# EAGLE design LIDAR_Motorsteuerung (EAGLE 7.6.0)
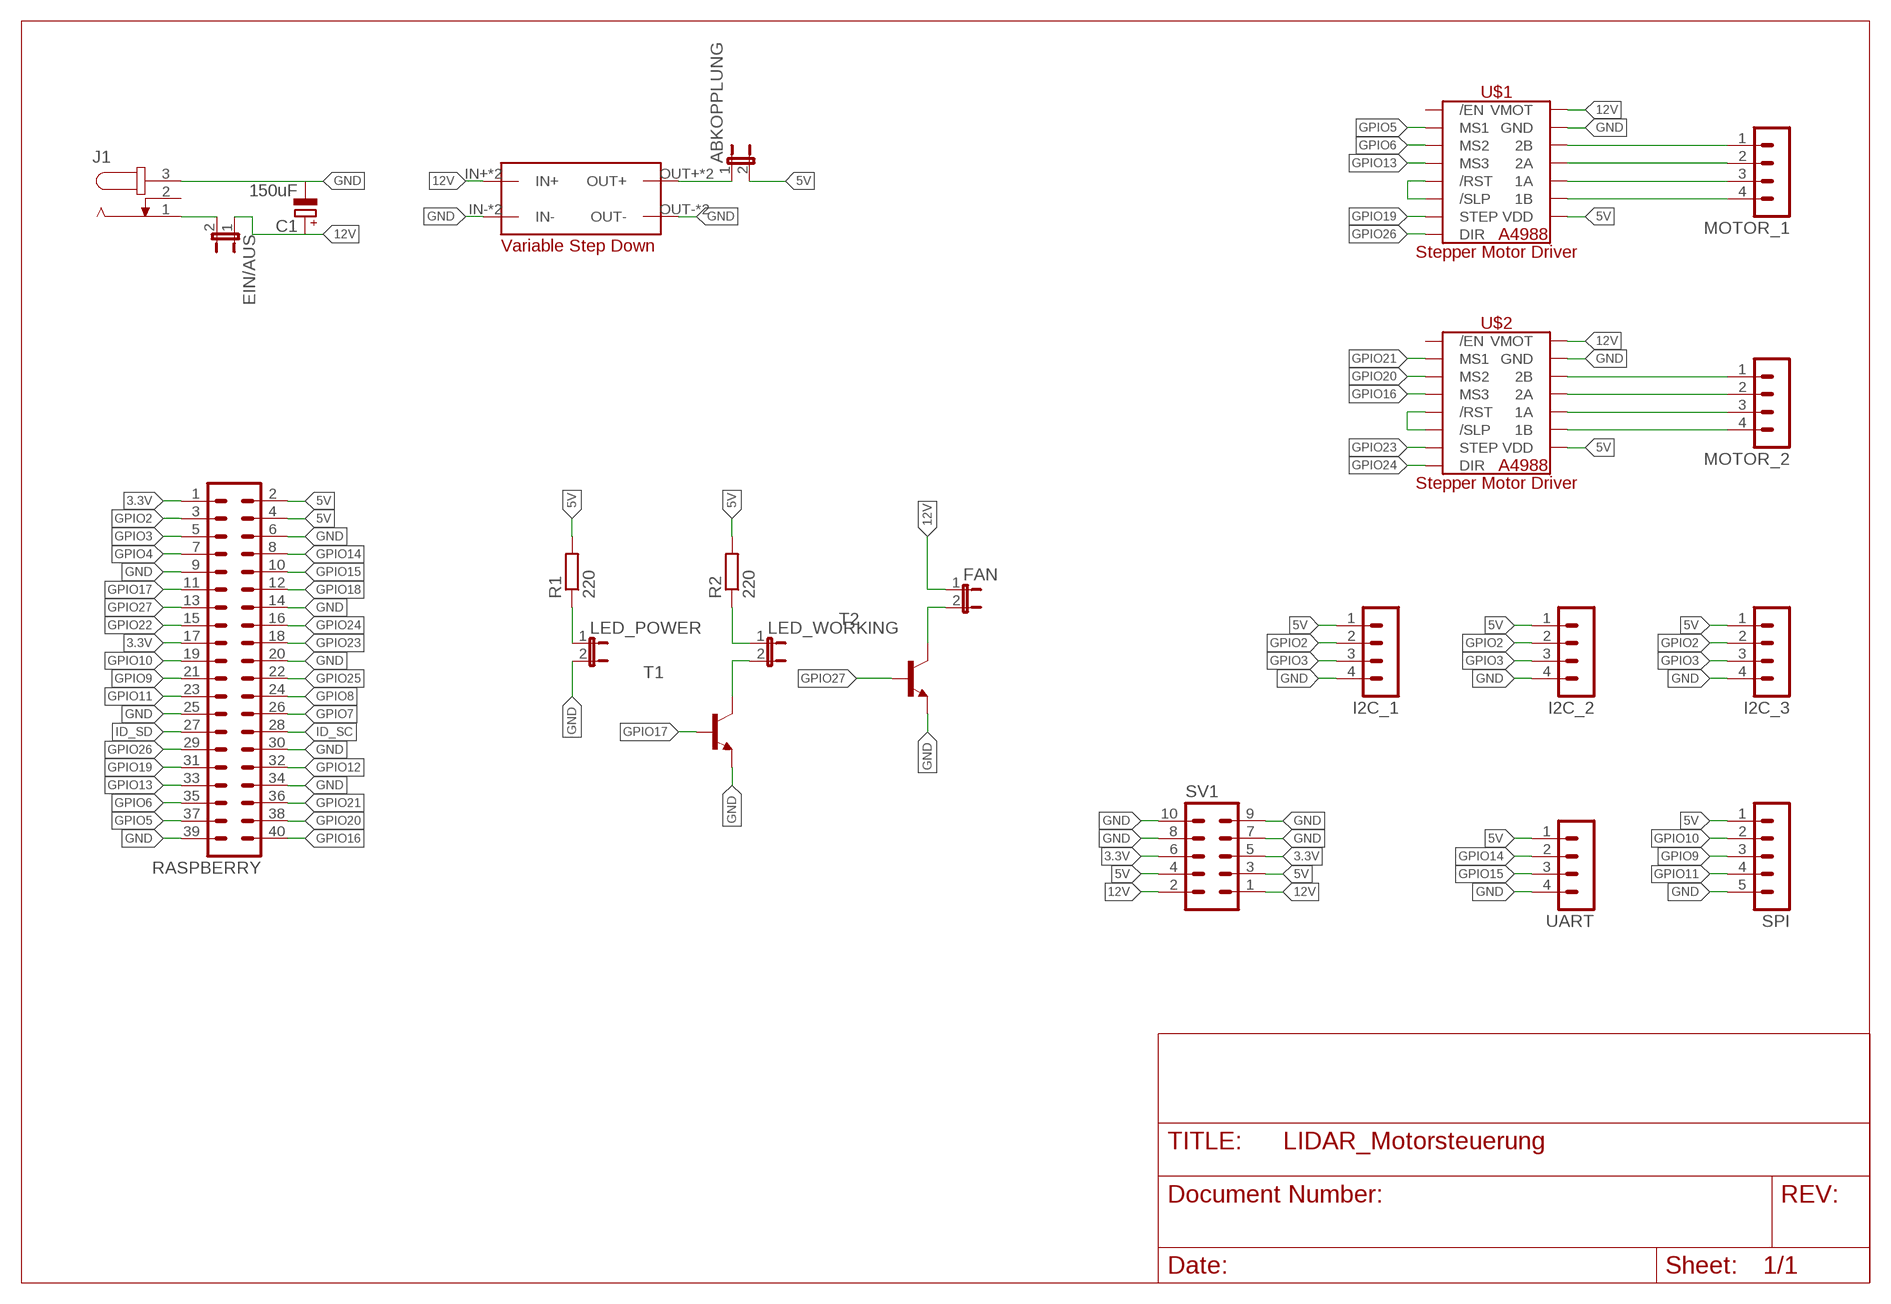
[diagram p0: schematic, sheet 1]

## Parts
ABKOPPLUNG  JP1E  [JP1]
C1  150uF  CPOL-EUE5-10.5  [E5-10,5]
EIN/AUS  JP1E  [JP1]
FAN  JP1E  [JP1]
I2C_1  MA04-1  [MA04-1]
I2C_2  MA04-1  [MA04-1]
I2C_3  MA04-1  [MA04-1]
J1  JACK-PLUG0  [SPC4077]
LED_POWER  JP1E  [JP1]
LED_WORKING  JP1E  [JP1]
MOTOR_1  MA04-1  [MA04-1]
MOTOR_2  MA04-1  [MA04-1]
R1  220  R-EU_0207/10  [0207/10]
R2  220  R-EU_0207/10  [0207/10]
RASPBERRY  MA20-2  [MA20-2]
SPI  MA05-1  [MA05-1]
SV1  MA05-2  [MA05-2]
T1  -NPN-TO92-EBC  [TO92-EBC]
T2  -NPN-TO92-EBC  [TO92-EBC]
U$1  A4988_STEP  [A4988_STEP]
U$2  A4988_STEP  [A4988_STEP]
U$3  STEP_DOWN  [STEP_DOWN]
UART  MA04-1  [MA04-1]

## Nets
3.3V: RASPBERRY.1 RASPBERRY.17 SV1.5 SV1.6
5V: ABKOPPLUNG.2 I2C_1.1 I2C_2.1 I2C_3.1 R1.2 R2.2 RASPBERRY.2 RASPBERRY.4 SPI.1 SV1.3 SV1.4 U$1.VDD U$2.VDD UART.1
12V: C1.+ EIN/AUS.1 FAN.1 SV1.1 SV1.2 U$1.VMOT U$2.VMOT U$3.IN+ U$3.IN+2(IN+)
GND: C1.- I2C_1.4 I2C_2.4 I2C_3.4 J1.3 LED_POWER.2 RASPBERRY.6 RASPBERRY.9 RASPBERRY.14 RASPBERRY.20 RASPBERRY.25 RASPBERRY.30 RASPBERRY.34 RASPBERRY.39 SPI.5 SV1.7 SV1.8 SV1.9 SV1.10 T1.E T2.E U$1.GND U$1.GND2(GND) U$2.GND U$2.GND2(GND) U$3.IN- U$3.IN-2(IN-) U$3.OUT- U$3.OUT-2(OUT-) UART.4
GPIO2: I2C_1.2 I2C_2.2 I2C_3.2 RASPBERRY.3
GPIO3: I2C_1.3 I2C_2.3 I2C_3.3 RASPBERRY.5
GPIO4: RASPBERRY.7
GPIO5: RASPBERRY.37 U$1.MS1
GPIO6: RASPBERRY.35 U$1.MS2
GPIO7: RASPBERRY.26
GPIO8: RASPBERRY.24
GPIO9: RASPBERRY.21 SPI.3
GPIO10: RASPBERRY.19 SPI.2
GPIO11: RASPBERRY.23 SPI.4
GPIO12: RASPBERRY.32
GPIO13: RASPBERRY.33 U$1.MS3
GPIO14: RASPBERRY.8 UART.2
GPIO15: RASPBERRY.10 UART.3
GPIO16: RASPBERRY.40 U$2.MS3
GPIO17: RASPBERRY.11 T1.B
GPIO18: RASPBERRY.12
GPIO19: RASPBERRY.31 U$1.STEP
GPIO20: RASPBERRY.38 U$2.MS2
GPIO21: RASPBERRY.36 U$2.MS1
GPIO22: RASPBERRY.15
GPIO23: RASPBERRY.18 U$2.STEP
GPIO24: RASPBERRY.16 U$2.DIR
GPIO25: RASPBERRY.22
GPIO26: RASPBERRY.29 U$1.DIR
GPIO27: RASPBERRY.13 T2.B
ID_SC: RASPBERRY.28
ID_SD: RASPBERRY.27
N$1: U$1./RST U$1./SLP
N$2: LED_POWER.1 R1.1
N$3: MOTOR_1.1 U$1.2B
N$4: MOTOR_1.2 U$1.2A
N$5: MOTOR_1.3 U$1.1A
N$6: MOTOR_1.4 U$1.1B
N$7: LED_WORKING.1 R2.1
N$8: LED_WORKING.2 T1.C
N$9: EIN/AUS.2 J1.1
N$10: MOTOR_2.1 U$2.2B
N$11: MOTOR_2.2 U$2.2A
N$12: MOTOR_2.3 U$2.1A
N$13: MOTOR_2.4 U$2.1B
N$16: FAN.2 T2.C
N$28: U$2./RST U$2./SLP
NET2: ABKOPPLUNG.1 U$3.OUT+ U$3.OUT+2(OUT+)
Unconnected: J1.2 U$1./EN U$2./EN

## Library data of the parts
ABKOPPLUNG EIN/AUS FAN LED_POWER LED_WORKING = jumper:JP1E: JUMPER
C1 = rcl:CPOL-EU: POLARIZED CAPACITOR, European symbol
I2C_1-I2C_3 MOTOR_1 MOTOR_2 UART = con-lstb:MA04-1: PIN HEADER; OC_FARNELL: unknown; OC_NEWARK: unknown
J1 = con-jack:JACK-PLUG: DC POWER JACK Power Jack, DC, Right Angle, Through Hole, Rated 5A at 16VDC, PC Terminals Distributor: Farnell (www.Farnell.de) Drawing: 84N1161.pdf / 84N1162.pdf Manufacturer: SPC Technology (www.spctechnology.com) Type: SPC4077 / SPC 4078; OC_FARNELL: unknown; OC_NEWARK: unknown
R1 R2 = rcl:R-EU_: RESISTOR, European symbol
RASPBERRY = con-lstb:MA20-2: PIN HEADER; OC_FARNELL: unknown; OC_NEWARK: unknown
SPI = con-lstb:MA05-1: PIN HEADER; OC_FARNELL: unknown; OC_NEWARK: unknown
SV1 = con-lstb:MA05-2: PIN HEADER; OC_FARNELL: unknown; OC_NEWARK: unknown
T1 T2 = transistor:*-NPN-: NPN Transistror BF959 corrected 2008.03.06
U$1 U$2 = Stepper:A4988_STEP
U$3 = Stepper:STEP_DOWN

## Board
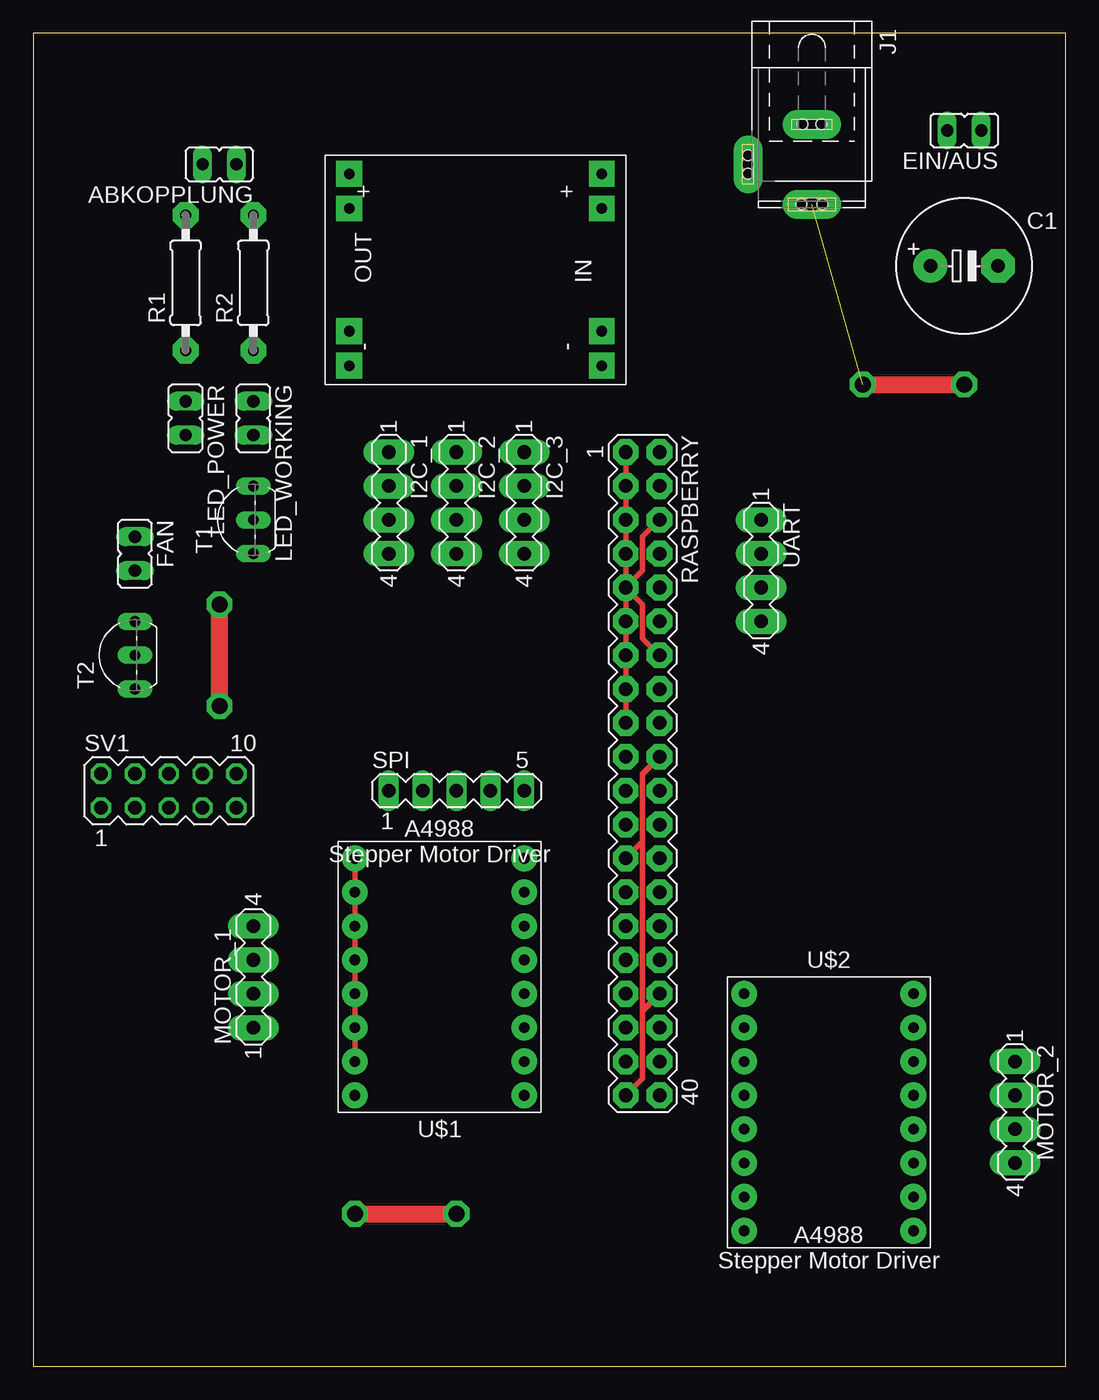
[diagram p1: board, top side]
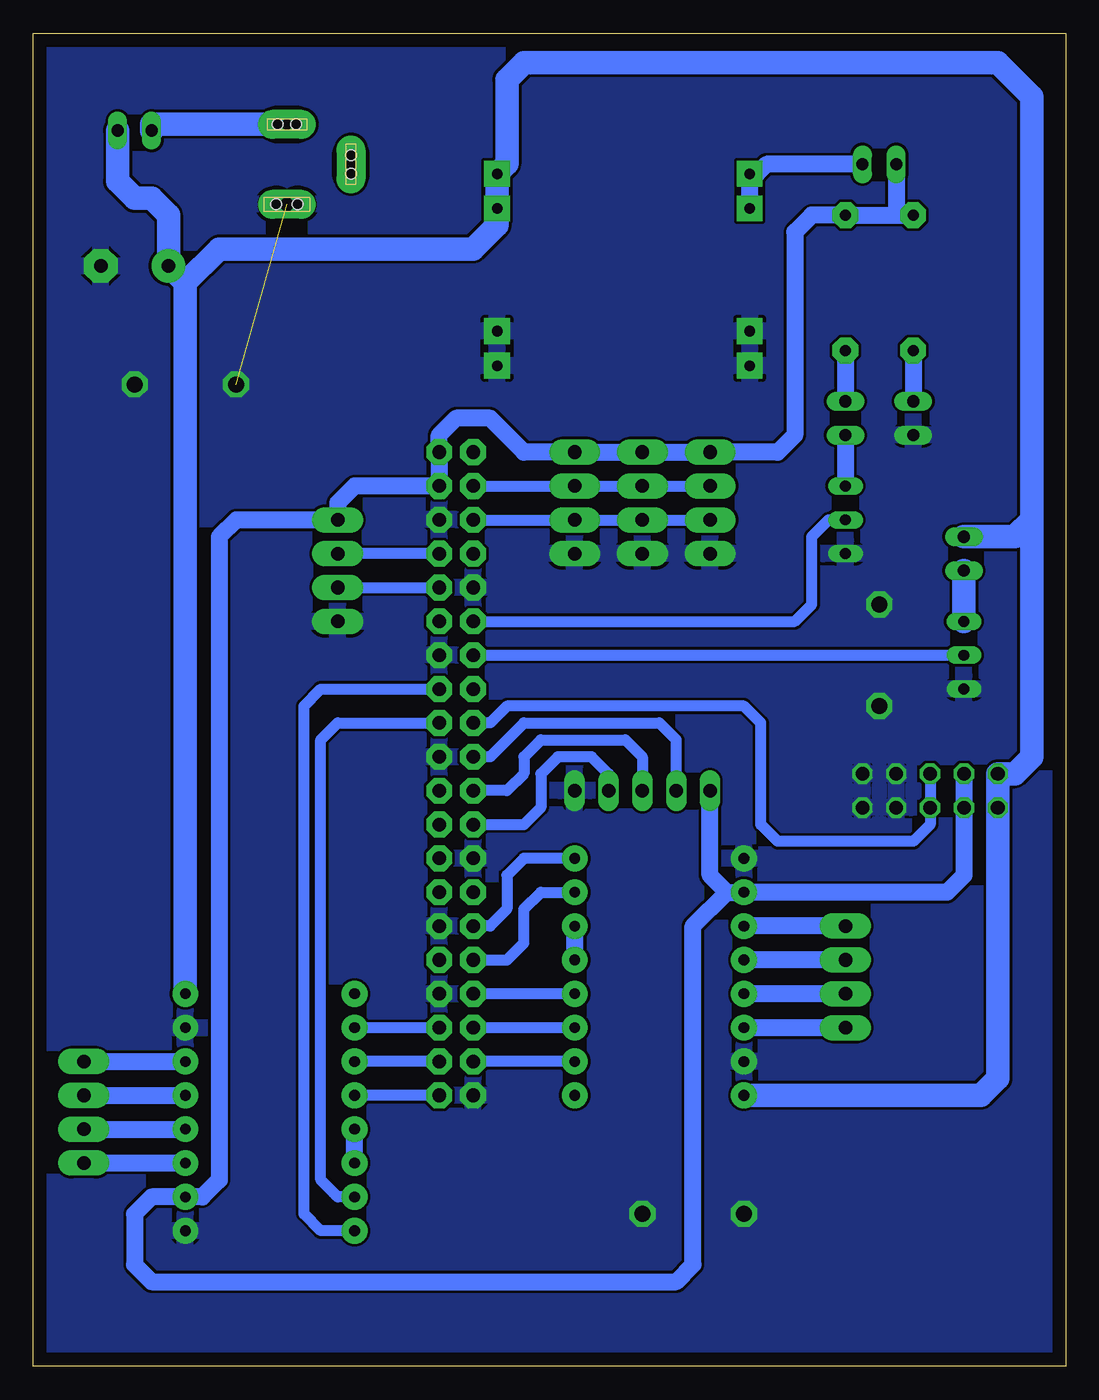
[diagram p2: board, bottom side, seen from below]

Size 77.45 x 100 mm. Coordinates in mm from the lower left corner, seen from the top.
Outline: 0,0 77.45,0 77.45,100 0,100 0,0
Copper layers (1*16): Top 0.035mm / dielectric 1.5mm / Bottom 0.035mm
Design rules "default": minimum track width 10mil, minimum drill 24mil, track to track 8mil, track to pad 8mil, pad to pad 8mil, via to via 8mil, smd to smd 8mil, copper to edge 40mil, drill to drill 8mil, minimum pad ring 10mil, minimum via ring 8mil, stop-mask expansion 4mil, vias tented up to drill 0mil, thermal gap 10mil

### Footprints (pad centres in the part's own frame; a part is rotated, then mirrored left to right if it is on the bottom)
JP1 = drill 0.914 long: 1 0,-1.27; 2 0,1.27
E5-10,5 = drill 1.016 pad 2.54: + -2.54,0 | drill 1.016 pad 2.54 octagon: - 2.54,0
MA04-1 = drill 1.016 pad 1.93 long: 1 -3.81,0; 2 -1.27,0; 3 1.27,0; 4 3.81,0
SPC4077 = drill 0.8 pad 2.184 long: 1 -3,0; 2 0,-4.8 | drill 1 pad 2.184 long: 3 3,0 | hole 0.8: 3,0.8; 3,-0.8; -3,0.7; -3,-0.7; -0.7,-4.8; 0.7,-4.8
0207/10 = drill 0.813 pad 1.93 octagon: 1 -5.08,0; 2 5.08,0
MA20-2 = drill 1.016 pad 1.93 octagon: 1 -24.13,-1.27; 2 -24.13,1.27; 3 -21.59,-1.27; 4 -21.59,1.27; 5 -19.05,-1.27; 6 -19.05,1.27; 7 -16.51,-1.27; 8 -16.51,1.27; 9 -13.97,-1.27; 10 -13.97,1.27; 11 -11.43,-1.27; 12 -11.43,1.27; 13 -8.89,-1.27; 14 -8.89,1.27; 15 -6.35,-1.27; 16 -6.35,1.27; 17 -3.81,-1.27; 18 -3.81,1.27; 19 -1.27,-1.27; 20 -1.27,1.27; 21 1.27,-1.27; 22 1.27,1.27; 23 3.81,-1.27; 24 3.81,1.27; 25 6.35,-1.27; 26 6.35,1.27; 27 8.89,-1.27; 28 8.89,1.27; 29 11.43,-1.27; 30 11.43,1.27; 31 13.97,-1.27; 32 13.97,1.27; 33 16.51,-1.27; 34 16.51,1.27; 35 19.05,-1.27; 36 19.05,1.27; 37 21.59,-1.27; 38 21.59,1.27; 39 24.13,-1.27; 40 24.13,1.27
MA05-1 = drill 1.016 long: 1 -5.08,0; 2 -2.54,0; 3 0,0; 4 2.54,0; 5 5.08,0
MA05-2 = drill 1.016 octagon: 1 -5.08,-1.27; 2 -5.08,1.27; 3 -2.54,-1.27; 4 -2.54,1.27; 5 0,-1.27; 6 0,1.27; 7 2.54,-1.27; 8 2.54,1.27; 9 5.08,-1.27; 10 5.08,1.27
TO92-EBC = drill 0.813 long: B 0,-1.27; C 2.54,-1.27; E -2.54,-1.27
A4988_STEP = drill 0.8 pad 1.93: 1A 6.35,-1.27; 1B 6.35,-3.81; 2A 6.35,1.27; 2B 6.35,3.81; /EN -6.35,8.89; /RST -6.35,-1.27; /SLP -6.35,-3.81; DIR -6.35,-8.89; GND 6.35,6.35; GND2 6.35,-8.89; MS1 -6.35,6.35; MS2 -6.35,3.81; MS3 -6.35,1.27; STEP -6.35,-6.35; VDD 6.35,-6.35; VMOT 6.35,8.89
STEP_DOWN = drill 0.8 pad 1.93 square: IN+ 13.2,1.8; IN+2 15.8,1.8; IN- 4,1.8; IN-2 1.4,1.8; OUT+ 13.2,20.75; OUT+2 15.8,20.75; OUT- 4,20.75; OUT-2 1.4,20.75

### Placement (x,y rotation side)
ABKOPPLUNG  13.97,90.17 90 top
C1  69.85,82.55 0 top
EIN/AUS  69.85,92.71 90 top
FAN  7.62,60.96 180 top
I2C_1  26.67,64.77 270 top
I2C_2  31.75,64.77 270 top
I2C_3  36.83,64.77 270 top
J1  58.42,90.17 270 top
LED_POWER  11.43,71.12 180 top
LED_WORKING  16.51,71.12 180 top
MOTOR_1  16.51,29.21 90 top
MOTOR_2  73.66,19.05 270 top
R1  11.43,81.28 90 top
R2  16.51,81.28 90 top
RASPBERRY  45.72,44.45 270 top
SPI  31.75,43.18 0 top
SV1  10.16,43.18 0 top
T1  15.24,63.5 90 top
T2  6.35,53.34 90 top
U$1  30.48,29.21 180 top
U$2  59.69,19.05 0 top
U$3  44.45,73.66 90 top
UART  54.61,59.69 270 top

### Tracks (layer width: path | path; a pad name or v marks a point on that pad's centre or on a via)
3.3V
  Top 0.406: RASPBERRY.17 RASPBERRY.1
  Bottom 0.813: RASPBERRY.17 43.18,48.26 41.91,49.53 24.13,49.53 22.86,48.26 22.86,40.64 21.59,39.37 11.43,39.37 10.16,40.64 SV1.6 SV1.5
5V
  Bottom 1.27: 12.7,86.36 R2.2 19.05,86.36 20.32,85.09 20.32,69.85 21.59,68.58 I2C_1.1 I2C_2.1 I2C_3.1 40.64,68.58 43.18,71.12 45.72,71.12 46.99,69.85 RASPBERRY.2 RASPBERRY.4 53.34,66.04 54.61,64.77 UART.1 62.23,63.5 63.5,62.23 63.5,13.97 64.77,12.7 U$2.VDD 68.58,12.7 69.85,11.43 69.85,7.62 68.58,6.35 29.21,6.35 27.94,7.62 27.94,33.02 25.4,35.56 | 12.7,86.36 R1.2 | ABKOPPLUNG.2 12.7,86.36 | SV1.4 SV1.3 7.62,36.83 8.89,35.56 U$1.VDD 25.4,35.56 | 25.4,35.56 26.67,36.83 SPI.1
12V
  Bottom 1.778: EIN/AUS.1 71.12,88.9 69.85,87.63 68.58,87.63 67.31,86.36 C1.+ 66.04,81.28 | 2.54,63.5 2.54,45.72 3.81,44.45 SV1.2 SV1.1 5.08,21.59 6.35,20.32 U$1.VMOT | 2.54,63.5 2.54,95.25 5.08,97.79 40.64,97.79 41.91,96.52 41.91,90.2 U$3.IN+2 U$3.IN+ 42.65,85.62 44.45,83.82 63.5,83.82 66.04,81.28 | FAN.1 3.81,62.23 2.54,63.5 | U$2.VMOT 66.04,81.28
GND  (via drill 1.2 pad 1.93)  (1 unrouted)
  Top 0.406: RASPBERRY.6 45.72,62.23 45.72,59.69 RASPBERRY.9 45.72,57.15 45.72,54.61 RASPBERRY.14 | RASPBERRY.25 45.72,39.37 | 45.72,39.37 45.72,44.45 RASPBERRY.20 | RASPBERRY.39 45.72,21.59 45.72,26.67 | 45.72,26.67 45.72,39.37 | RASPBERRY.34 45.72,26.67 | U$1.GND2 U$1.GND
  Top 1.27: v62.23,73.66 v69.85,73.66 | v24.13,11.43 v31.75,11.43 | v13.97,49.53 v13.97,57.15
  pour Bottom: 0,0 0,100.33 77.47,100.33 77.47,0
GPIO2
  Bottom 0.813: I2C_1.2 I2C_2.2 I2C_3.2 RASPBERRY.3
GPIO3
  Bottom 0.813: I2C_1.3 I2C_2.3 I2C_3.3 RASPBERRY.5
GPIO5
  Bottom 0.813: U$1.MS1 RASPBERRY.37
GPIO6
  Bottom 0.813: U$1.MS2 RASPBERRY.35
GPIO9
  Bottom 0.813: RASPBERRY.21 41.91,43.18 40.64,44.45 40.64,45.72 39.37,46.99 33.02,46.99 31.75,45.72 SPI.3
GPIO10
  Bottom 0.813: RASPBERRY.19 43.18,45.72 40.64,48.26 30.48,48.26 29.21,46.99 SPI.2
GPIO11
  Bottom 0.813: RASPBERRY.23 40.64,40.64 39.37,41.91 39.37,44.45 38.1,45.72 35.56,45.72 34.29,44.45 SPI.4
GPIO13
  Bottom 0.813: U$1.MS3 RASPBERRY.33
GPIO14
  Bottom 0.813: RASPBERRY.8 UART.2
GPIO15
  Bottom 0.813: UART.3 RASPBERRY.10
GPIO16
  Bottom 0.813: RASPBERRY.40 U$2.MS3
GPIO17
  Bottom 0.813: RASPBERRY.11 20.32,55.88 19.05,57.15 19.05,62.23 17.78,63.5 T1.B
GPIO19
  Bottom 0.813: RASPBERRY.31 41.91,30.48 40.64,31.75 40.64,34.29 39.37,35.56 U$1.STEP
GPIO20
  Bottom 0.813: RASPBERRY.38 U$2.MS2
GPIO21
  Bottom 0.813: RASPBERRY.36 U$2.MS1
GPIO23
  Bottom 0.813: U$2.STEP 54.61,12.7 55.88,13.97 55.88,46.99 54.61,48.26 RASPBERRY.18
GPIO24
  Bottom 0.813: U$2.DIR 55.88,10.16 57.15,11.43 57.15,49.53 55.88,50.8 RASPBERRY.16
GPIO26
  Bottom 0.813: U$1.DIR 40.64,38.1 41.91,36.83 41.91,34.29 43.18,33.02 RASPBERRY.29
GPIO27
  Bottom 0.813: RASPBERRY.13 T2.B
N$1
  Bottom 1.27: U$1./SLP U$1./RST
N$2
  Bottom 1.27: R1.1 LED_POWER.1
N$3
  Bottom 1.27: MOTOR_1.1 U$1.2B
N$4
  Bottom 1.27: MOTOR_1.2 U$1.2A
N$5
  Bottom 1.27: MOTOR_1.3 U$1.1A
N$6
  Bottom 1.27: MOTOR_1.4 U$1.1B
N$7
  Bottom 1.27: R2.1 LED_WORKING.1
N$8
  Bottom 1.27: LED_WORKING.2 T1.C
N$9
  Bottom 1.778: J1.1 68.58,93.17 EIN/AUS.2
N$10
  Bottom 1.27: MOTOR_2.1 U$2.2B
N$11
  Bottom 1.27: MOTOR_2.2 U$2.2A
N$12
  Bottom 1.27: MOTOR_2.3 U$2.1A
N$13
  Bottom 1.27: MOTOR_2.4 U$2.1B
N$16
  Bottom 1.778: FAN.2 T2.C
N$28
  Bottom 1.27: U$2./SLP U$2./RST
NET2
  Bottom 1.27: U$3.OUT+ 23.7,88.9 | 23.7,88.9 U$3.OUT+2 | ABKOPPLUNG.1 22.43,90.17 23.7,88.9